# EAGLE schematic rfid_vratnik_arduino (EAGLE 9.0.1)
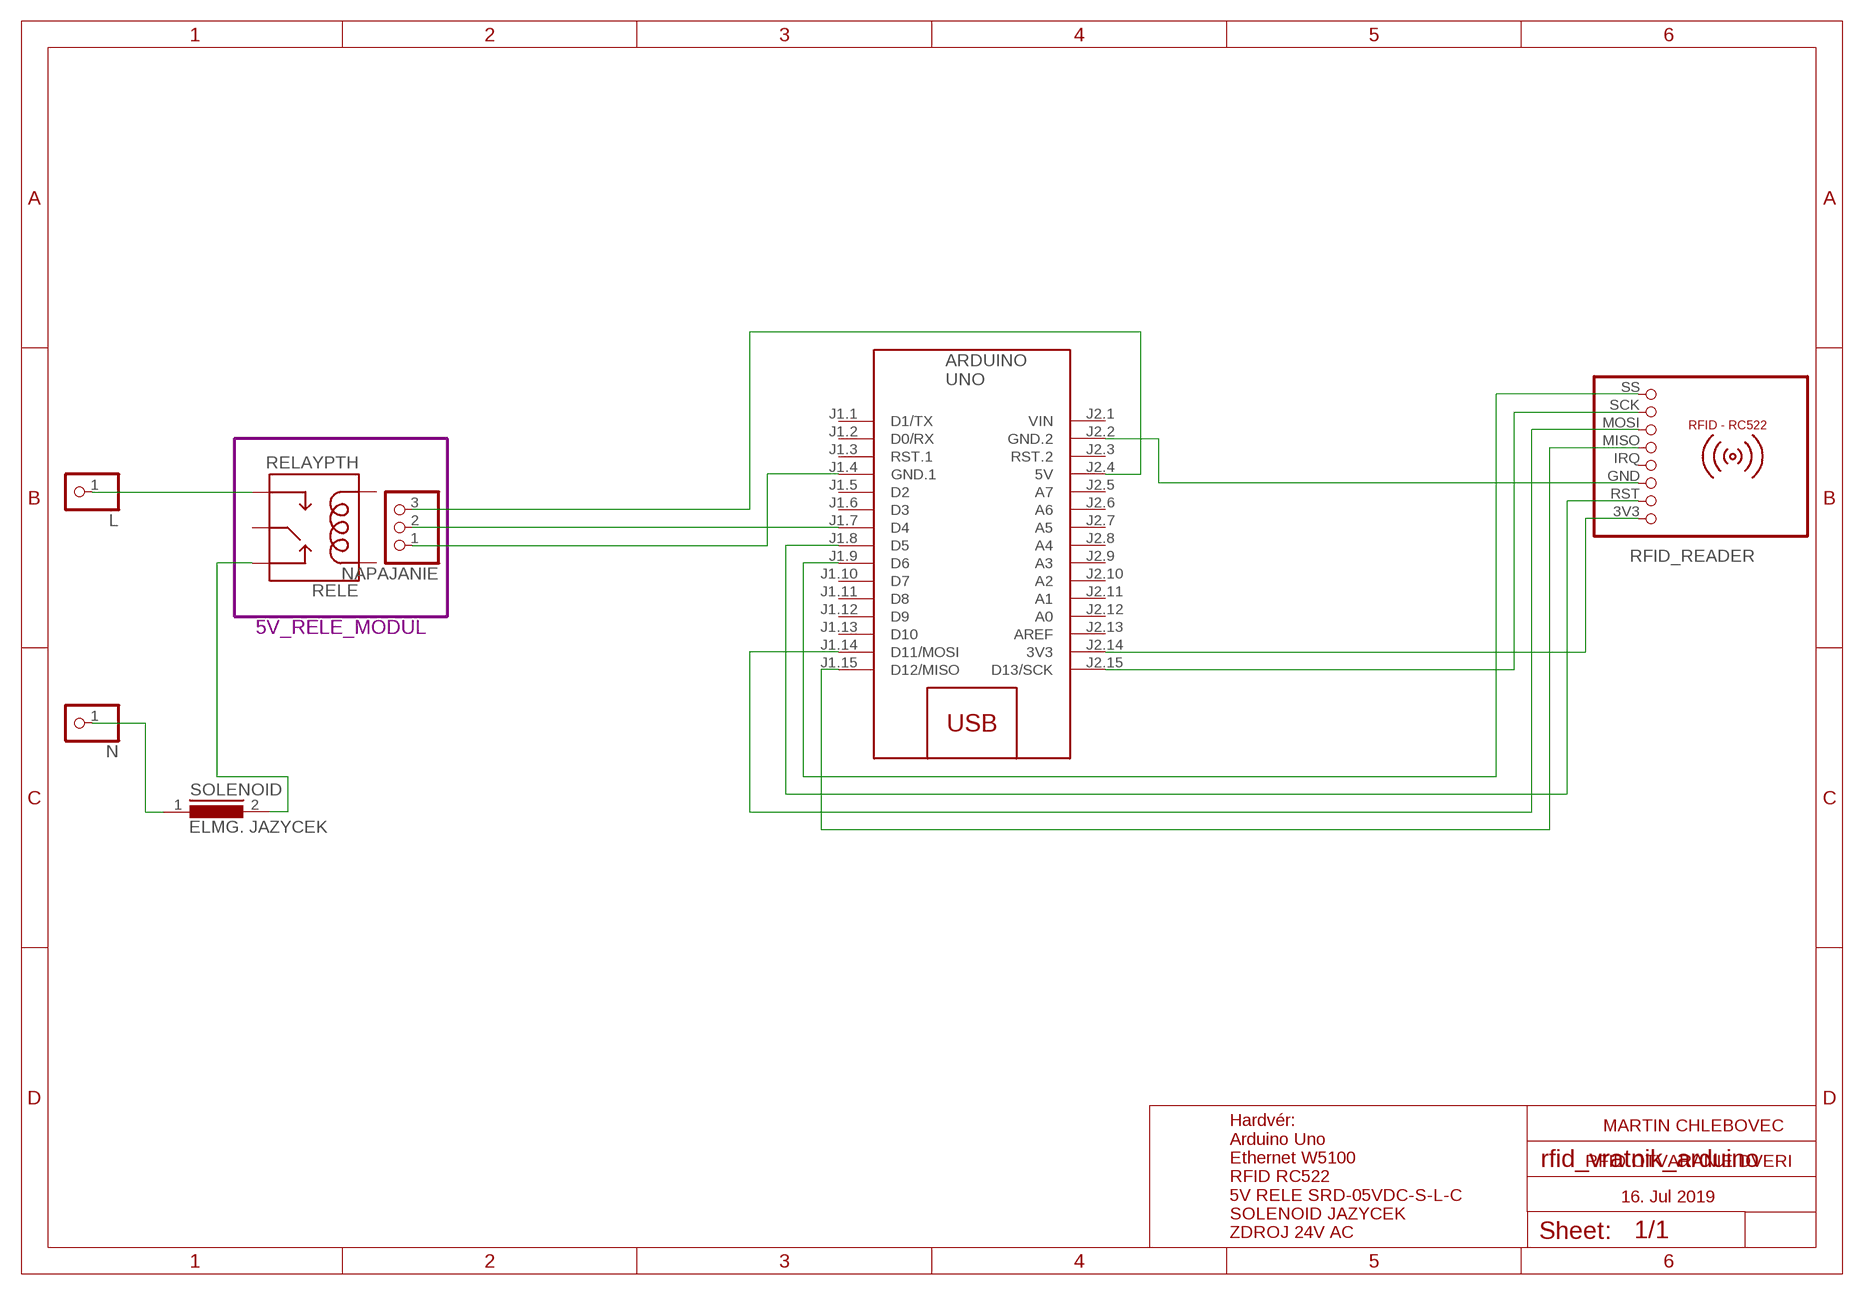
[diagram p0: schematic, sheet 1]

## Parts
L  PINHD-1X1CB  [1X01-CLEANBIG]
M1  ARDUINO-NANO-3.0  [ARDUINO-NANO-3.0]
N  PINHD-1X1CB  [1X01-CLEANBIG]
NAPAJANIE  PINHD-1X3  [1X03]
RELE  RELAYPTH  [SRD-05VDC-SL-C]
RFID_READER  RFID-RC522  [RFID-RC522]
SOLENOID  ELMG. JAZYCEK  SLF7045  [SLF7045]

## Module instances
5V_RELE_MODUL = RELE

## Nets
N$1: M1.J1.9(D6) RFID_READER.SS
N$2: M1.J1.4(GND.1) NAPAJANIE.1
N$4: M1.J1.8(D5) RFID_READER.RST
N$5: M1.J2.2(GND.2) RFID_READER.GND
N$6: M1.J1.15(D12/MISO) RFID_READER.MISO
N$7: M1.J1.14(D11/MOSI) RFID_READER.MOSI
N$8: M1.J2.4(5V) NAPAJANIE.3
N$9: M1.J1.7(D4) NAPAJANIE.2
N$10: M1.J2.15(D13/SCK) RFID_READER.SCK
N$11: L.1 RELE.SWOPEN
N$12: N.1 SOLENOID.1
N$13: RELE.SWCLOSED(SWCLOSE) SOLENOID.2
N$14: M1.J2.14(3V3) RFID_READER.3V3
Unconnected: M1.J1.1(D1/TX) M1.J1.2(D0/RX) M1.J1.3(RST.1) M1.J1.5(D2) M1.J1.6(D3) M1.J1.10(D7) M1.J1.11(D8) M1.J1.12(D9) M1.J1.13(D10) M1.J2.3(RST.2) M1.J2.5(A7) M1.J2.6(A6) M1.J2.7(A5) M1.J2.8(A4) M1.J2.9(A3) M1.J2.10(A2) M1.J2.11(A1) M1.J2.12(A0) M1.J2.13(AREF) RELE.COIL0 RELE.COIL1 RELE.SWCOMMON RFID_READER.IRQ

## Notes on the sheet
- ARDUINO
  UNO
- MARTIN CHLEBOVEC
- RFID OTVARANIE DVERI
- 16. Jul 2019
- Hardvér:
  Arduino Uno
  Ethernet W5100
  RFID RC522
  5V RELE SRD-05VDC-S-L-C
  SOLENOID JAZYCEK
  ZDROJ 24V AC

## Power pins joined to a net without a drawn wire
VIN: M1.J2.1(VIN)

## Library data of the parts
L N = adafruit:PINHD-1X1: Pin header 1x1 for 0.1" spacing With round pins
M1 = diy-modules (1):ARDUINO-NANO-3.0: Arduino Nano 3.0 and compatible devices More details available here: https://www.arduino.cc/en/Main/ArduinoBoardNano Click here to find device on ebay.com <http://www.ebay.com/sch/arduino+nano>
NAPAJANIE = pinhead:PINHD-1X3: PIN HEADER
RELE = SRD-05VDC-SL-C:RELAY: SPDT relay (COM-00101)
RFID_READER = mfrc522-module:RFID-RC522: RFID-RC522 MFRC-522 based breakout board
SOLENOID = inductors:SLF7045: SMD Inductors(Coils) For Power Line (Wound, Magnetic Shielded) Source: TDK, e531_slf7045.pdf; SPICEPREFIX: L

## Module RELE
Ports: 

### Library data of the parts